# Altium schematic sheet ARCADE_BUTTONS.SchDoc
size A4; SheetNumber: 8; SheetTotal: 11
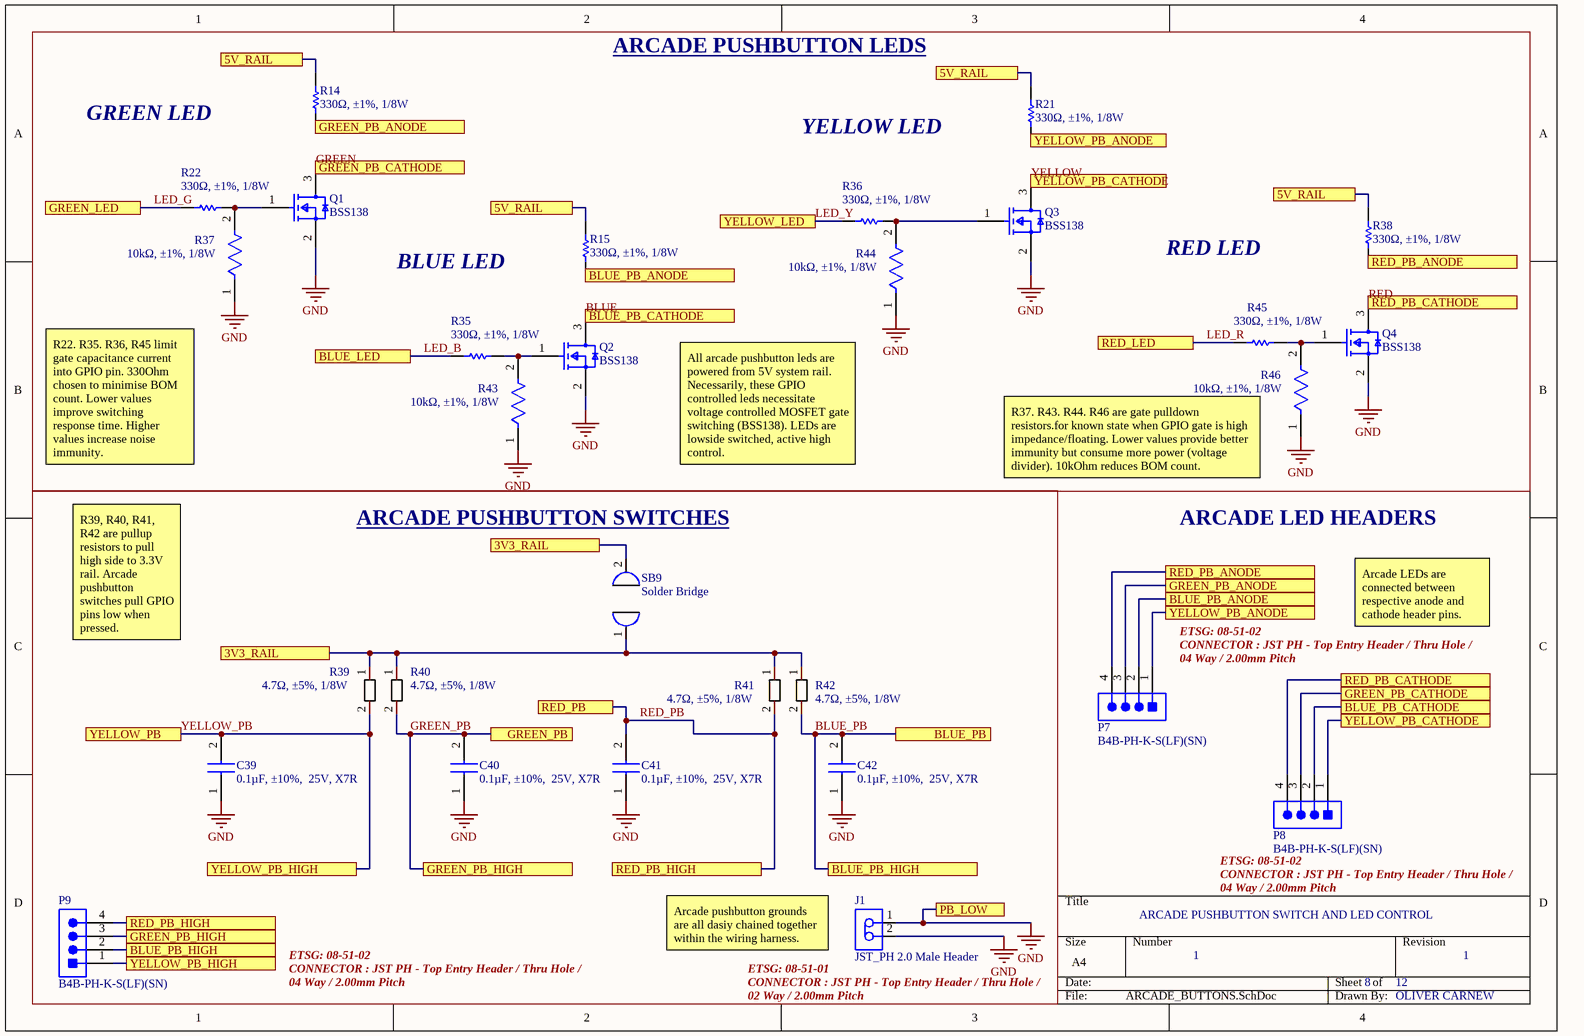
[diagram p0: ARCADE_BUTTONS.SchDoc]

## Parts
C39  0.1µF, ±10%,  25V, X7R  [CAPC1005X55N]
C40  0.1µF, ±10%,  25V, X7R  [CAPC1005X55N]
C41  0.1µF, ±10%,  25V, X7R  [CAPC1005X55N]
C42  0.1µF, ±10%,  25V, X7R  [CAPC1005X55N]
J1  JST_PH 2.0 Male Header  [JST-B2B-PH-K-S_V]
P7  B4B-PH-K-S(LF)(SN)  [JST-B4B-PH-K-S_V]
P8  B4B-PH-K-S(LF)(SN)  [JST-B4B-PH-K-S_V]
P9  B4B-PH-K-S(LF)(SN)  [JST-B4B-PH-K-S_V]
Q1  BSS138  [FP-318-08-IPC_B]
Q2  BSS138  [FP-318-08-IPC_B]
Q3  BSS138  [FP-318-08-IPC_B]
Q4  BSS138  [FP-318-08-IPC_B]
R14  330Ω, ±1%, 1/8W  [RESC1608X55X30ML20T10]
R15  330Ω, ±1%, 1/8W  [RESC1608X55X30ML20T10]
R21  330Ω, ±1%, 1/8W  [RESC1608X55X30ML20T10]
R22  330Ω, ±1%, 1/8W  [RESC1608X55X30ML20T10]
R35  330Ω, ±1%, 1/8W  [RESC1608X55X30ML20T10]
R36  330Ω, ±1%, 1/8W  [RESC1608X55X30ML20T10]
R37  10kΩ, ±1%, 1/8W  [FP-MCT0603-MFG]
R38  330Ω, ±1%, 1/8W  [RESC1608X55X30ML20T10]
R39  4.7Ω, ±5%, 1/8W  [SURFM RESISTOR]
R40  4.7Ω, ±5%, 1/8W  [SURFM RESISTOR]
R41  4.7Ω, ±5%, 1/8W  [SURFM RESISTOR]
R42  4.7Ω, ±5%, 1/8W  [SURFM RESISTOR]
R43  10kΩ, ±1%, 1/8W  [FP-MCT0603-MFG]
R44  10kΩ, ±1%, 1/8W  [FP-MCT0603-MFG]
R45  330Ω, ±1%, 1/8W  [RESC1608X55X30ML20T10]
R46  10kΩ, ±1%, 1/8W  [FP-MCT0603-MFG]
SB9  Solder Bridge  [SOLDER BRIDGE OPEN SMALL]

## Blocks framed on the sheet
ARCADE PUSHBUTTON SWITCHES: C39-C42 J1 P9 R39-R42 SB9

## Ports
3V3_RAIL, 5V_RAIL, BLUE_LED, BLUE_PB, BLUE_PB_ANODE, BLUE_PB_CATHODE, BLUE_PB_HIGH, GREEN_LED, GREEN_PB, GREEN_PB_ANODE, GREEN_PB_CATHODE, GREEN_PB_HIGH, PB_LOW, RED_LED, RED_PB, RED_PB_ANODE, RED_PB_CATHODE, RED_PB_HIGH, YELLOW_LED, YELLOW_PB, YELLOW_PB_ANODE, YELLOW_PB_CATHODE, YELLOW_PB_HIGH

## Nets
GND: C39.1 C40.1 C41.1 C42.1 J1.1 J1.2 Q1.2(S) Q2.2(S) Q3.2(S) Q4.2(S) R37.1 R43.1 R44.1 R46.1 ; port PB_LOW
3V3_RAIL: R39.1 R40.1 R41.1 R42.1 SB9.1 SB9.2 ; port 3V3_RAIL
5V_RAIL: R14.2 R15.2 R21.2 R38.2 ; port 5V_RAIL
BLUE: P8.2 Q2.3(D) ; port BLUE_PB_CATHODE
BLUE_PB: C42.2 P9.2 R42.2 ; port BLUE_PB, port BLUE_PB_HIGH
BLUE_PB_ANODE: P7.2 R15.1 ; port BLUE_PB_ANODE
GREEN: P8.3 Q1.3(D) ; port GREEN_PB_CATHODE
GREEN_PB: C40.2 P9.3 R40.2 ; port GREEN_PB, port GREEN_PB_HIGH
GREEN_PB_ANODE: P7.3 R14.1 ; port GREEN_PB_ANODE
LED_B: R35.2 ; port BLUE_LED
LED_G: R22.2 ; port GREEN_LED
LED_R: R45.2 ; port RED_LED
LED_Y: R36.2 ; port YELLOW_LED
RED: P8.4 Q4.3(D) ; port RED_PB_CATHODE
RED_PB: C41.2 P9.4 R41.2 ; port RED_PB, port RED_PB_HIGH
RED_PB_ANODE: P7.4 R38.1 ; port RED_PB_ANODE
YELLOW: P8.1 Q3.3(D) ; port YELLOW_PB_CATHODE
YELLOW_PB: C39.2 P9.1 R39.2 ; port YELLOW_PB, port YELLOW_PB_HIGH
YELLOW_PB_ANODE: P7.1 R21.1 ; port YELLOW_PB_ANODE
NetQ1_1: Q1.1(G) R22.1 R37.2
NetQ2_1: Q2.1(G) R35.1 R43.2
NetQ3_1: Q3.1(G) R36.1 R44.2
NetQ4_1: Q4.1(G) R45.1 R46.2

## Notes on the sheet
- ARCADE PUSHBUTTON LEDS
- GREEN LED
- YELLOW LED
- BLUE LED
- RED LED
- R22. R35. R36, R45 limit gate capacitance current into GPIO pin. 330Ohm chosen to minimise BOM count. Lower values improve switching response time. Higher values increase noise immunity.
- All arcade pushbutton leds are powered from 5V system rail. Necessarily, these GPIO controlled leds necessitate voltage controlled MOSFET gate switching (BSS138). LEDs are lowside switched, active high control.
- R37. R43. R44. R46 are gate pulldown resistors.for known state when GPIO gate is high impedance/floating. Lower values provide better immunity but consume more power (voltage divider). 10kOhm reduces BOM count.
- ARCADE LED HEADERS
- R39, R40, R41, R42 are pullup resistors to pull high side to 3.3V rail. Arcade pushbutton switches pull GPIO pins low when pressed.
- ETSG: 08-51-02
- (near P7) CONNECTOR : JST PH - Top Entry Header / Thru Hole /
- Arcade LEDs are connected between respective anode and cathode header pins.
- (near P7) 04 Way / 2.00mm Pitch
- ARCADE PUSHBUTTON SWITCH AND LED CONTROL
- CONNECTOR : JST PH - Top Entry Header / Thru Hole /
- 04 Way / 2.00mm Pitch
- Arcade pushbutton grounds are all dasiy chained together within the wiring harness.
- ETSG: 08-51-01
- (near J1) CONNECTOR : JST PH - Top Entry Header / Thru Hole /
- 1
- 8
- 12
- 02 Way / 2.00mm Pitch
- OLIVER CARNEW

## Library data of the parts
C39-C42 = CL05B104KA5NNNC: Capacitor CAP CER 0.1UF 25V X7R 0402 CL05B104KA5NNNC; Manufacturer_Name: SAMSUNG; Datasheet Link: https://datasheet.datasheetarchive.com/originals/distributors/DKDS-19/372989.pdf; Height: 0.55mm; Manufacturer_Part_Number: CL05B104KA5NNNC; Mouser Part Number: 187-CL05B104KA5NNNC; Mouser Price/Stock: https://www.mouser.co.uk/ProductDetail/Samsung-Electro-Mechanics/CL05B104KA5NNNC?qs=Efv9o2T6U88DLyyMSzjXSQ%3D%3D; Arrow Part Number: CL05B104KA5NNNC; Arrow Price/Stock: https://www.arrow.com/en/products/cl05b104ka5nnnc/samsung-electro-mechanics?region=nac; Parameter 1: Capacitor CAP CER 0.1UF 25V X7R 0402 CL05B104KA5NNNC
J1 = CMP-2000-05162-1: Male Header, Pitch 2 mm, 1 x 2 Position, Height 6 mm, Tail Length 3.4 mm, -25 to 85 degC, RoHS, Bulk B2B-PH-K-S(LF)(SN) / CONNECTOR : JST PH - Top Entry Header / Thru Hole / 02 Way / 2.00mm Pitch ___ 08-51-01; Pitch: 2mm; Style/Orientation: StraightHeader/Plug; No of Positions: 2; Datasheet Version: Nov-08; Datasheet URL: http://datasheet.octopart.com/B2B-PH-K-S%28LF%29%28SN%29-JST-datasheet-8324864.pdf; Manufacturer URL: http://www.jst.com/home2.html; Type: ShroudedHeader; Termination: Crimp; Manufacturer: JST
P7 P8 = CMP-2000-05165-1: Male Header, Pitch 2 mm, 1 x 4 Position, Height 6 mm, Tail Length 3.4 mm, -25 to 85 degC, RoHS, Bulk; Manufacturer: JST; No of Positions: 4; Style/Orientation: StraightHeader/Plug; Pitch: 2mm; Datasheet URL: http://datasheet.octopart.com/B4B-PH-K-S%28LF%29%28SN%29-JST-datasheet-10558886.pdf; Type: ShroudedHeader; Manufacturer URL: http://www.jst.com/home2.html; Termination: Crimp; Datasheet Version: Apr-09
P9 = CMP-2000-05165-1: Male Header, Pitch 2 mm, 1 x 4 Position, Height 6 mm, Tail Length 3.4 mm, -25 to 85 degC, RoHS, Bulk CONNECTOR : JST PH - Top Entry Header / Thru Hole / 04 Way / 2.00mm Pitch. ETSG: 08-51-02; No of Positions: 4; Style/Orientation: StraightHeader/Plug; Pitch: 2mm; Manufacturer: JST; Datasheet URL: http://datasheet.octopart.com/B4B-PH-K-S%28LF%29%28SN%29-JST-datasheet-10558886.pdf; Type: ShroudedHeader; Manufacturer URL: http://www.jst.com/home2.html; Termination: Crimp; Datasheet Version: Apr-09
Q1-Q4 = CMP-07173-000101-1: MOSFET N-CH 50V 220MA SOT-23; Turn-Off Delay Time: 20ns; Element Configuration: Single; Rds On Max: 3.5R; Gate to Source Voltage (Vgs): 20V; Threshold Voltage: 1.3V; Number of Elements: 1; Power Dissipation: 360mW; Rise Time: 9ns; Turn-On Delay Time: 2.5ns; Input Capacitance: 27pF; On-State Resistance: 6R; Lead Free: Lead Free; Length: 2.92mm; Width: 1.3mm; Drain to Source Breakdown Voltage: 50V; Min Operating Temperature: -55°C; REACH SVHC: No SVHC; Packaging: Tape and Reel; Radiation Hardening: No; Height: 0.93mm; Drain to Source Voltage (Vdss): 50V; Current Rating: 220mA; Voltage Rating (DC): 50V; Weight: 0.03g; Continuous Drain Current (ID): 220mA; Number of Pins: 3; Nominal Vgs: 1.3V; Max Power Dissipation: 360mW; Fall Time: 9ns; Drain to Source Resistance: 3.5R; Contact Plating: Tin; Case/Package: SOT-23; Package Quantity: 1; Dual Supply Voltage: 50V; Mount: Surface Mount; Termination: SMD/SMT; Max Operating Temperature: 150°C
R14 R15 R21 R22 R35 R36 R38 R45 = CMP-2000-01422-1: RK73H1JTTD3300F 330 Ohms ±1% 0.125W, 1/8W Chip Resistor 0603 (1608 Metric) Automotive AEC-Q200 Thick Film; Manufacturer: KOA Speer; Part Number: RK73H1JTTD3300F
R37 R43 R44 R46 = CMP-02407-001346-1: RES SMD 10KOHM 1% 1/8W 0603 MCT0603MC1002FP500; Voltage Rating: 75V; Power Rating: 125mW; Resistance: 10kR; Length: 1.6mm; Case Code (Metric): 1608; Composition: Thin Film; Height: 0.45mm; Weight: 7.1E-05oz; Min Operating Temperature: -55°C; Packaging: Tape and Reel; Width: 0.8mm; Case/Package: 0603; Tolerance: 1%; Termination: SMD/SMT; Package Quantity: 5000; Case Code (Imperial): 0603; Max Operating Temperature: 155°C
R39-R42 = 0805-R: Chip Resistor, 4.7 KOhm, +/- 1%, 0.1 W, -55 to 155 degC, 0603 (1608 Metric), RoHS, Tape and Reel RC0603FR-074K7L
SB9 = SOLDER_BRIDGE_TDROP: Tension Fill Solder Bridge